# EAGLE design Kit 10 Pin Inverter (EAGLE 7.2.0)
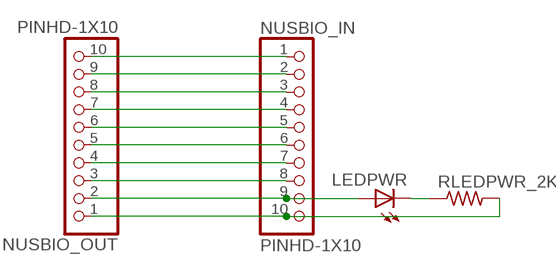
[diagram p0: schematic, sheet 1]

## Parts
LEDPWR  LEDCHIPLED_0805  [CHIPLED_0805]
NUSBIO_IN  PINHD-1X10  [1X10-BIG]
NUSBIO_OUT  PINHD-1X10  [1X10-BIG]
RLEDPWR_2K  R-US_R0805  [R0805]

## Nets
N$1: NUSBIO_IN.1 NUSBIO_OUT.10
N$2: NUSBIO_IN.2 NUSBIO_OUT.9
N$3: NUSBIO_IN.3 NUSBIO_OUT.8
N$4: NUSBIO_IN.4 NUSBIO_OUT.7
N$5: NUSBIO_IN.5 NUSBIO_OUT.6
N$6: NUSBIO_IN.6 NUSBIO_OUT.5
N$7: NUSBIO_IN.7 NUSBIO_OUT.4
N$8: NUSBIO_IN.8 NUSBIO_OUT.3
N$9: LEDPWR.A NUSBIO_IN.9 NUSBIO_OUT.2
N$10: NUSBIO_IN.10 NUSBIO_OUT.1 RLEDPWR_2K.2
N$11: LEDPWR.C RLEDPWR_2K.1

## Library data of the parts
LEDPWR = adafruit:LED: LED OSRAM: - CHIPLED LG R971, LG N971, LY N971, LG Q971, LY Q971, LO R971, LY R971 LH N974, LH R974 LS Q976, LO Q976, LY Q976 LO Q996 - Hyper CHIPLED LW Q18S LB Q993, LB Q99A, LB R99A - SideLED LS A670, LO A670, LY A670, LG A670, LP A670 LB A673, LV A673, LT A673, LW A673 LH A674 LY A675 LS A676, LA A676, LO A676, LY A676, LW A676 LS A679, LY A679, LG A679 - Hyper Micro SIDELED® LS Y876, LA Y876, LO Y876, LY Y876 LT Y87S - SmartLED LW L88C, LW L88S LB L89C, LB L89S, LG L890 LS L89K, LO L89K, LY L89K LS L896, LA L896, LO L896, LY L896 - TOPLED LS T670, LO T670, LY T670, LG T670, LP T670 LSG T670, LSP T670, LSY T670, LOP T670, LYG T670 LG T671, LOG T671, LSG T671 LB T673, LV T673, LT T673, LW T673 LH T674 LS T676, LA T676, LO T676, LY T676, LB T676, LH T676, LSB T676, LW T676 LB T67C, LV T67C, LT T67C, LS T67K, LO T67K, LY T67K, LW E67C LS E67B, LA E67B, LO E67B, LY E67B, LB E67C, LV E67C, LT E67C LW T67C LS T679, LY T679, LG T679 LS T770, LO T770, LY T770, LG T770, LP T770 LB T773, LV T773, LT T773, LW T773 LH T774 LS E675, LA E675, LY E675, LS T675 LS T776, LA T776, LO T776, LY T776, LB T776 LHGB T686 LT T68C, LB T68C - Hyper Mini TOPLED® LB M676 - Mini TOPLED Santana® LG M470 LS M47K, LO M47K, LY M47K Source: http://www.osram.convergy.de/
NUSBIO_IN NUSBIO_OUT = adafruit:PINHD-1X10: Pin header 1x10 0.1" spacing With round pins
RLEDPWR_2K = adafruit:R-US_: RESISTOR, American symbol

## Board
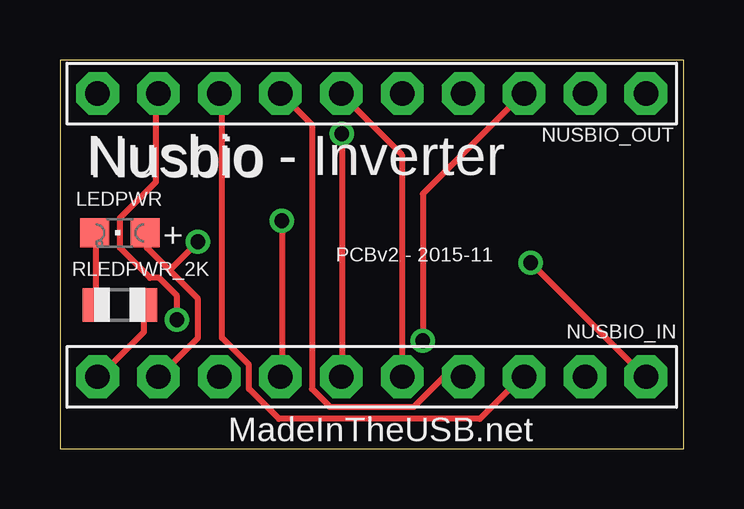
[diagram p1: board, top side]
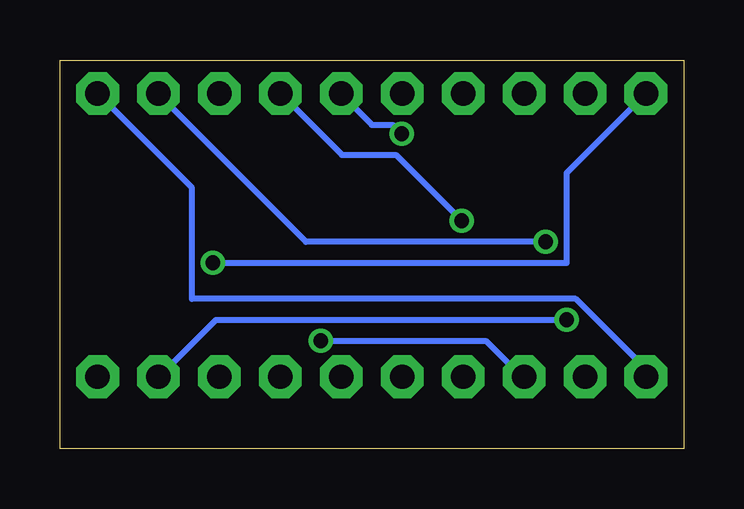
[diagram p2: board, bottom side, seen from below]

Size 26 x 16.2 mm. Coordinates in mm from the lower left corner, seen from the top.
Outline: 0,0 26,0 26,16.2 0,16.2 0,0
Copper layers (1*16): Top 0.035mm / dielectric 1.5mm / Bottom 0.035mm
Design rules "default": minimum track width 10mil, minimum drill 24mil, track to track 8mil, track to pad 8mil, pad to pad 8mil, via to via 8mil, smd to smd 8mil, copper to edge 40mil, drill to drill 8mil, minimum pad ring 10mil, minimum via ring 8mil, stop-mask expansion 4mil, vias tented up to drill 0mil, thermal gap 10mil

### Footprints (pad centres in the part's own frame; a part is rotated, then mirrored left to right if it is on the bottom)
CHIPLED_0805 = smd 1.2 x 1.2: A 0,-1.05; C 0,1.05
1X10-BIG = drill 1.016 pad 1.778 octagon: 1 -11.43,0; 2 -8.89,0; 3 -6.35,0; 4 -3.81,0; 5 -1.27,0; 6 1.27,0; 7 3.81,0; 8 6.35,0; 9 8.89,0; 10 11.43,0
R0805 = smd 1.1 x 1.4: 1 -1,0; 2 1,0

### Placement (x,y rotation side)
LEDPWR  2.5,9 90 top
NUSBIO_IN  13,3 180 top
NUSBIO_OUT  13,14.8 180 top
RLEDPWR_2K  2.5,6 0 top

### Tracks (layer width: path | path; a pad name or v marks a point on that pad's centre or on a via)
N$1  (via drill 0.61)
  Top 0.254: v19.62,7.75 24.38,3 NUSBIO_IN.1
  Bottom 0.254: v19.62,7.75 4.88,7.75 4.88,11.5 1.62,14.75 NUSBIO_OUT.10
N$2  (via drill 0.61)
  Top 0.254: v4.88,5.38 4.88,6.38 4.12,7.12 3.75,7.12 2.5,8.38 2.5,9.62 4,11.12 4,14.75 NUSBIO_OUT.9
  Bottom 0.254: v4.88,5.38 19.5,5.38 21.88,3 NUSBIO_IN.2
N$3
  Top 0.254: NUSBIO_OUT.8 6.75,14.75 6.75,4.62 7.88,3.5 7.88,2.5 9.12,1.25 17.5,1.25 19.25,3 NUSBIO_IN.3
N$4
  Top 0.254: NUSBIO_IN.4 16,3 14.75,1.75 11.25,1.75 10.5,2.5 10.5,13.5 9.25,14.75 NUSBIO_OUT.7
N$5
  Top 0.254: NUSBIO_IN.5 14.25,3 14.25,12.25 11.75,14.75 NUSBIO_OUT.6
N$6  (via drill 0.61)
  Top 0.254: v11.75,13.12 11.75,3 NUSBIO_IN.6
  Bottom 0.254: v11.75,13.12 12.12,13.5 13,13.5 14.25,14.75 NUSBIO_OUT.5
N$7  (via drill 0.61)
  Top 0.254: v9.25,9.5 9.25,3 NUSBIO_IN.7
  Bottom 0.254: v9.25,9.5 12,12.25 14.25,12.25 16.75,14.75 NUSBIO_OUT.4
N$8  (via drill 0.61)
  Top 0.254: v15.12,4.5 15.12,10.62 19.25,14.75 NUSBIO_OUT.3
  Bottom 0.254: v15.12,4.5 8.25,4.5 6.75,3 NUSBIO_IN.8
N$9  (via drill 0.61)
  Top 0.254: 4.56,7.44 5.75,6.25 5.75,4.62 4.12,3 NUSBIO_IN.9 | 4.56,7.44 3.62,8.38 3.62,9 LEDPWR.A | 4.56,7.44 v5.75,8.62
  Bottom 0.254: v5.75,8.62 15.75,8.62 21.88,14.75 NUSBIO_OUT.2
N$10
  Top 0.254: RLEDPWR_2K.2 3.5,4.88 1.62,3 NUSBIO_IN.10
  Bottom 0.254: NUSBIO_OUT.1 24.38,14.75 20.5,10.88 20.5,6.25 4.5,6.25 1.62,3.38 1.62,3 NUSBIO_IN.10
N$11
  Top 0.254: RLEDPWR_2K.1 1.5,9 LEDPWR.C

### Text on the board
tNames: Nusbio - Inverter | Nusbio | + | PCBv2 - 2015-11 | MadeInTheUSB.net